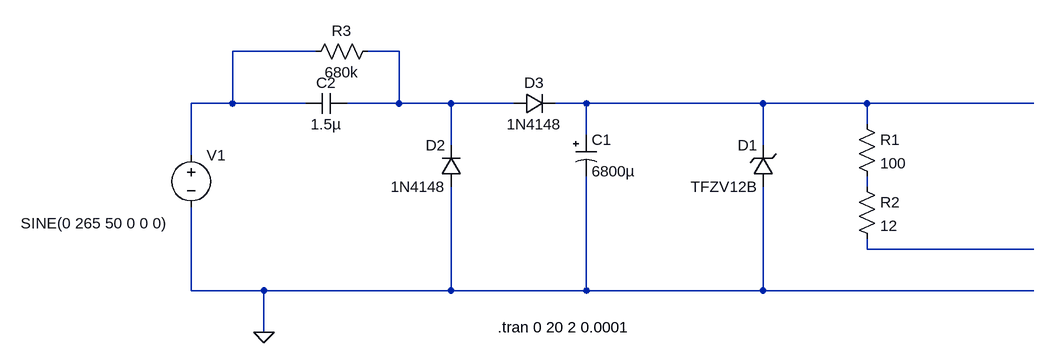
[diagram p0: schematic Final_PSU.asc]
Final_PSU.asc, the LTspice schematic file:
Version 4
SHEET 1 1616 680
WIRE -240 -32 -368 -32
WIRE -112 -32 -160 -32
WIRE -368 48 -368 -32
WIRE -368 48 -432 48
WIRE -256 48 -368 48
WIRE -112 48 -112 -32
WIRE -112 48 -192 48
WIRE -32 48 -112 48
WIRE 64 48 -32 48
WIRE 176 48 128 48
WIRE 448 48 176 48
WIRE 608 48 448 48
WIRE 864 48 608 48
WIRE 608 80 608 48
WIRE 176 96 176 48
WIRE -32 112 -32 48
WIRE 448 112 448 48
WIRE -432 128 -432 48
WIRE 608 176 608 160
WIRE 608 272 608 256
WIRE 864 272 608 272
WIRE -432 336 -432 208
WIRE -320 336 -432 336
WIRE -32 336 -32 176
WIRE -32 336 -320 336
WIRE 176 336 176 160
WIRE 176 336 -32 336
WIRE 448 336 448 176
WIRE 448 336 176 336
WIRE 864 336 448 336
WIRE -320 400 -320 336
FLAG -320 400 0
SYMBOL voltage -432 112 R0
WINDOW 123 0 0 Left 0
WINDOW 39 0 0 Left 0
WINDOW 3 -262 120 Left 2
SYMATTR Value SINE(0 265 50 0 0 0)
SYMATTR InstName V1
SYMBOL zener 464 176 R180
WINDOW 0 24 64 Left 2
WINDOW 3 24 0 Left 2
SYMATTR InstName D1
SYMATTR Value TFZV12B
SYMBOL res -144 -48 R90
WINDOW 0 0 56 VBottom 2
WINDOW 3 32 56 VTop 2
SYMATTR InstName R3
SYMATTR Value 680k
SYMBOL polcap 160 96 R0
SYMATTR InstName C1
SYMATTR Value 6800µ
SYMBOL diode -16 176 R180
WINDOW 0 24 64 Left 2
WINDOW 3 24 0 Left 2
SYMATTR InstName D2
SYMATTR Value 1N4148
SYMBOL diode 64 64 R270
WINDOW 0 32 32 VTop 2
WINDOW 3 0 32 VBottom 2
SYMATTR InstName D3
SYMATTR Value 1N4148
SYMBOL cap -192 32 R90
WINDOW 0 0 32 VBottom 2
WINDOW 3 32 32 VTop 2
SYMATTR InstName C2
SYMATTR Value 1.5µ
SYMBOL res 592 64 R0
SYMATTR InstName R1
SYMATTR Value 100
SYMBOL res 592 160 R0
SYMATTR InstName R2
SYMATTR Value 12
TEXT 40 392 Left 2 !.tran 0 20 2 0.0001

The netlist it stands for:
* Final_PSU.asc
V1 N001 0 SINE(0 265 50 0 0 0)
D1 0 N003 TFZV12B
R3 N002 N001 680k
C1 N003 0 6800µ
D2 0 N002 1N4148
D3 N002 N003 1N4148
C2 N002 N001 1.5µ
R1 N003 N004 100
R2 N004 N005 12
.model D D
.lib standard.dio
.tran 0 20 2 0.0001
.backanno
.end